# EAGLE design NRF24L01_LCD5110 (EAGLE 6.4)
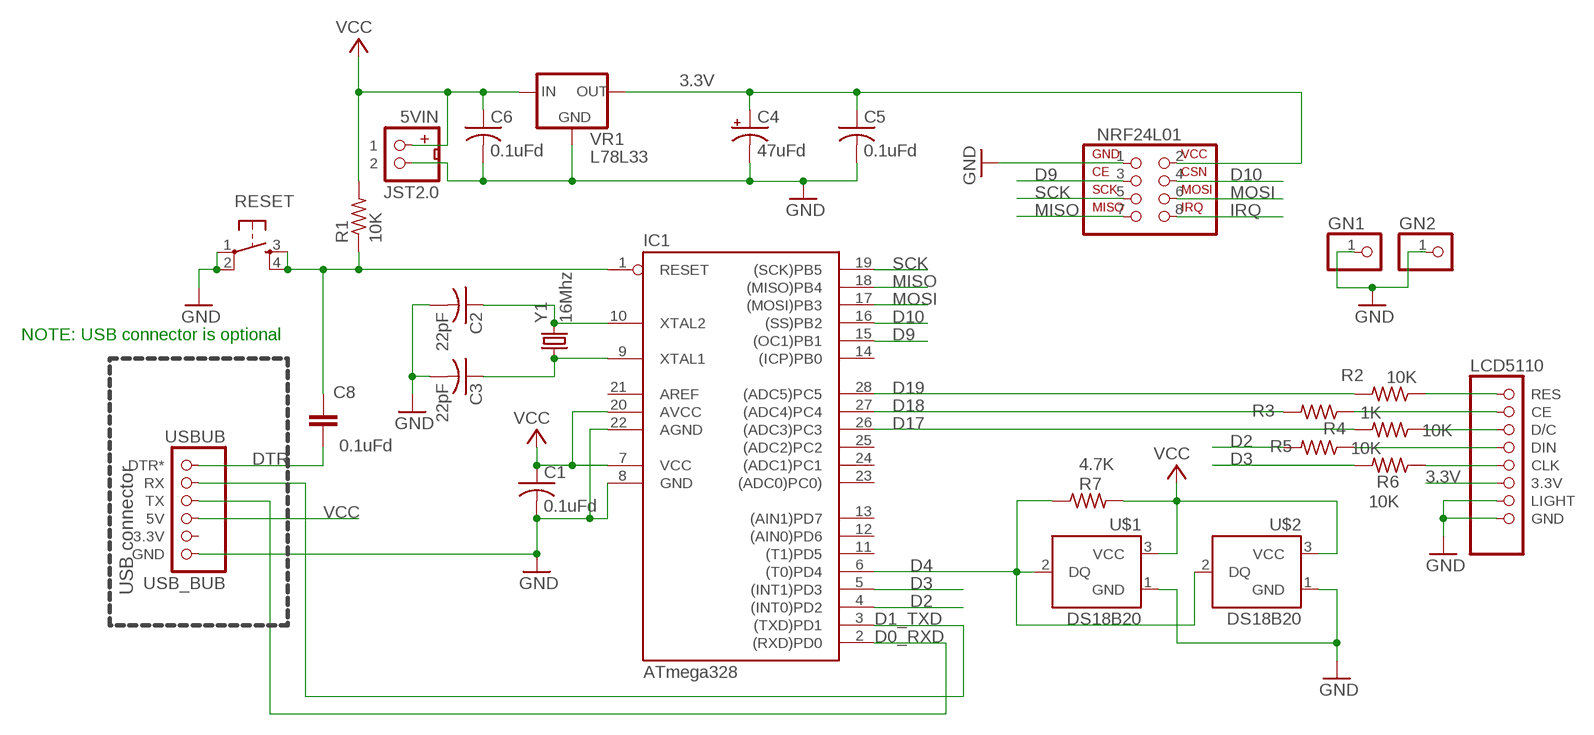
[diagram p0: schematic, sheet 1]

## Parts
5VIN  JST2.0  [JST2.0]
C1  0.1uFd  C-US050-025X075  [C050-025X075]
C2  22pF  C-US025-025X050  [C025-025X050]
C3  22pF  C-US025-025X050  [C025-025X050]
C4  47uFd  CPOL-USE2,5-6E  [E2,5-6E]
C5  0.1uFd  C-US025-025X050  [C025-025X050]
C6  0.1uFd  C-US050-025X075  [C050-025X075]
C8  0.1uFd  C-EU050-025X075  [C050-025X075]
GN1  PINHD-1X1  [1X01]
GN2  PINHD-1X1  [1X01]
IC1  ATmega328  AT90S4433P  [DIL28-3]
LCD5110  LCD5110_1TOP  [LCD5110T1]
NRF24L01  NRF24L01+  [NRF24L01+]
R1  10K  R-US_0207/2V  [0207/2V]
R2  10K  R-US_0207/5V  [0207/5V]
R3  1K  R-US_0207/5V  [0207/5V]
R4  10K  R-US_0207/5V  [0207/5V]
R5  10K  R-US_0207/5V  [0207/5V]
R6  10K  R-US_0207/5V  [0207/5V]
R7  4.7K  R-US_0207/2V  [0207/2V]
RESET  TAC_SWITCHPTH  [TACTILE-PTH]
U$1  DS18B20  [DS18B20]
U$2  DS18B20  [DS18B20]
USBUB  USB_BUB  [USB_BUB]
VR1  L78L33  78LXX  [78LXX]
Y1  16Mhz  CRYSTALHC49US  [HC49US]

## Nets
3.3V: C4.+ C5.1 LCD5110.3.3V NRF24L01.2 VR1.OUT
D0_RXD: IC1.2((RXD)PD0) USBUB.TX
D1_TXD: IC1.3((TXD)PD1) USBUB.RX
D2: IC1.4((INT0)PD2) R5.2
D3: IC1.5((INT1)PD3) R6.2
D4: IC1.6((T0)PD4) R7.1 U$1.2(DQ) U$2.2(DQ)
D9: IC1.15((OC1)PB1) NRF24L01.3
D10: IC1.16((SS)PB2) NRF24L01.4
D17: IC1.26((ADC3)PC3) R4.2
D18: IC1.27((ADC4)PC4) R3.2
D19: IC1.28((ADC5)PC5) R2.2
DTR: C8.1 USBUB.DTR*
GND [power]: 5VIN.2 C1.2 C2.2 C3.2 C4.- C5.2 C6.2 GN1.1 GN2.1 IC1.8(GND) IC1.22(AGND) LCD5110.GND LCD5110.LIGHT NRF24L01.1 RESET.1 RESET.2 U$1.1(GND) U$2.1(GND) USBUB.GND VR1.GND
IRQ: NRF24L01.8
MISO: IC1.18((MISO)PB4) NRF24L01.7
MOSI: IC1.17((MOSI)PB3) NRF24L01.6
N$1: LCD5110.RES R2.1
N$3: LCD5110.CE R3.1
N$5: LCD5110.D/C R4.1
N$6: C3.1 IC1.9(XTAL1) Y1.1
N$7: C2.1 IC1.10(XTAL2) Y1.2
N$8: LCD5110.DIN R5.1
N$9: LCD5110.CLK R6.1
RESET: C8.2 IC1.1(RESET) R1.1 RESET.3 RESET.4
SCK: IC1.19((SCK)PB5) NRF24L01.5
VCC: 5VIN.1 C1.1 C6.1 IC1.7(VCC) IC1.20(AVCC) R1.2 R7.2 U$1.3(VCC) U$2.3(VCC) USBUB.5V VR1.IN
Unconnected: IC1.11((T1)PD5) IC1.12((AIN0)PD6) IC1.13((AIN1)PD7) IC1.14((ICP)PB0) IC1.21(AREF) IC1.23((ADC0)PC0)) IC1.24((ADC1)PC1) IC1.25((ADC2)PC2) USBUB.3.3V

## Notes on the sheet
- NOTE: USB connector is optional
- USB connector

## Library data of the parts
5VIN = MTS_Custom:JST2.0
C1-C3 C5 C6 = MTS:C-US: CAPACITOR, American symbol
C4 = rcl:CPOL-US: POLARIZED CAPACITOR, American symbol
C8 = my-rcl:C-EU: CAPACITOR, European symbol
GN1 GN2 = pinhead:PINHD-1X1: PIN HEADER
IC1 = atmel:AT90S4433: MICROCONTROLLER 4 Kbytes FLASH 128 bytes SRAM 256 bytes EEPROM UART 6-channel 10 bit ADC
LCD5110 = MTS_Custom:LCD5110_1
NRF24L01 = MTS_Custom:NRF24L01+
R1-R7 = MTS:R-US_: RESISTOR, American symbol
RESET = SparkFun:TAC_SWITCH: Momentary Switch Button commonly used for reset or general input. Spark Fun Electronics SKU : COM-00097
U$1 U$2 = MTS_Custom:DS18B20
USBUB = MTS:USB_BUB
VR1 = v-reg:78LXX: VOLTAGE REGULATOR
Y1 = MTS:CRYSTAL: Crystals Various standard crystals. Proven footprints. Spark Fun Electronics SKU : COM-00534

## Net classes
0 default: width 0.4 mm, clearance 0.3 mm
1 power: width 0.6 mm, clearance 0.3 mm

## Board
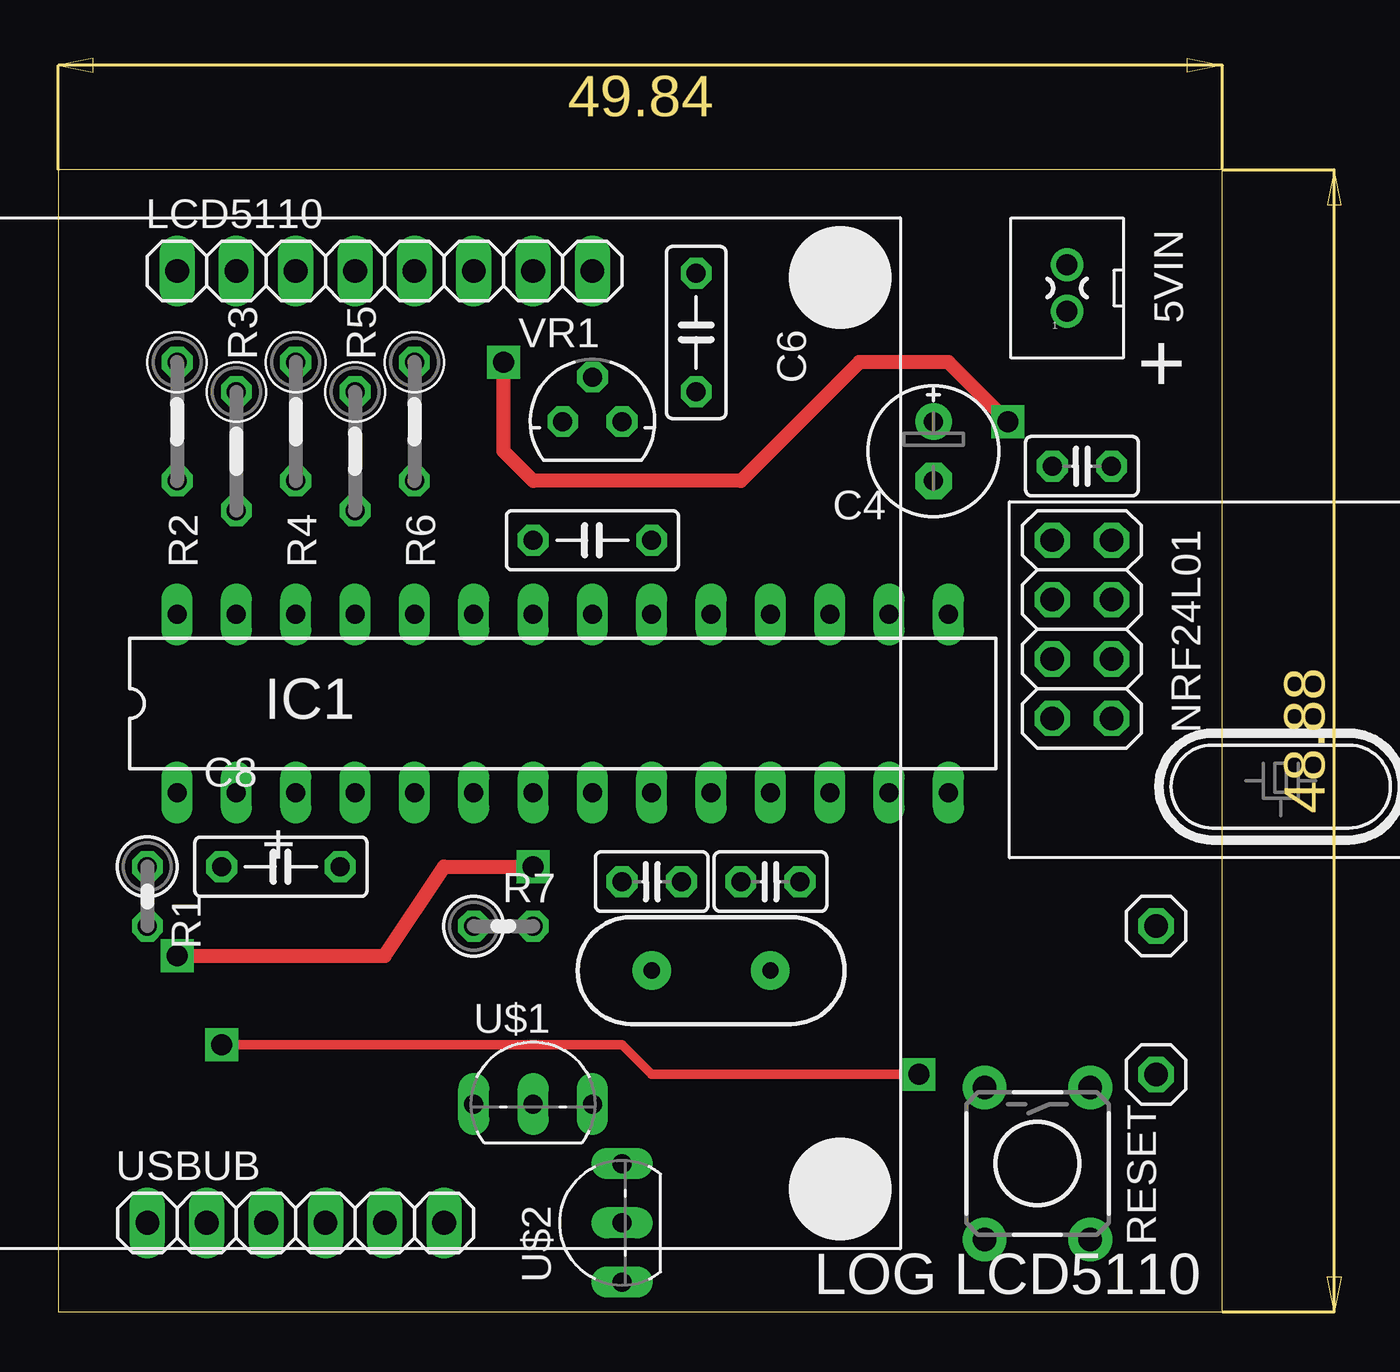
[diagram p1: board, top side]
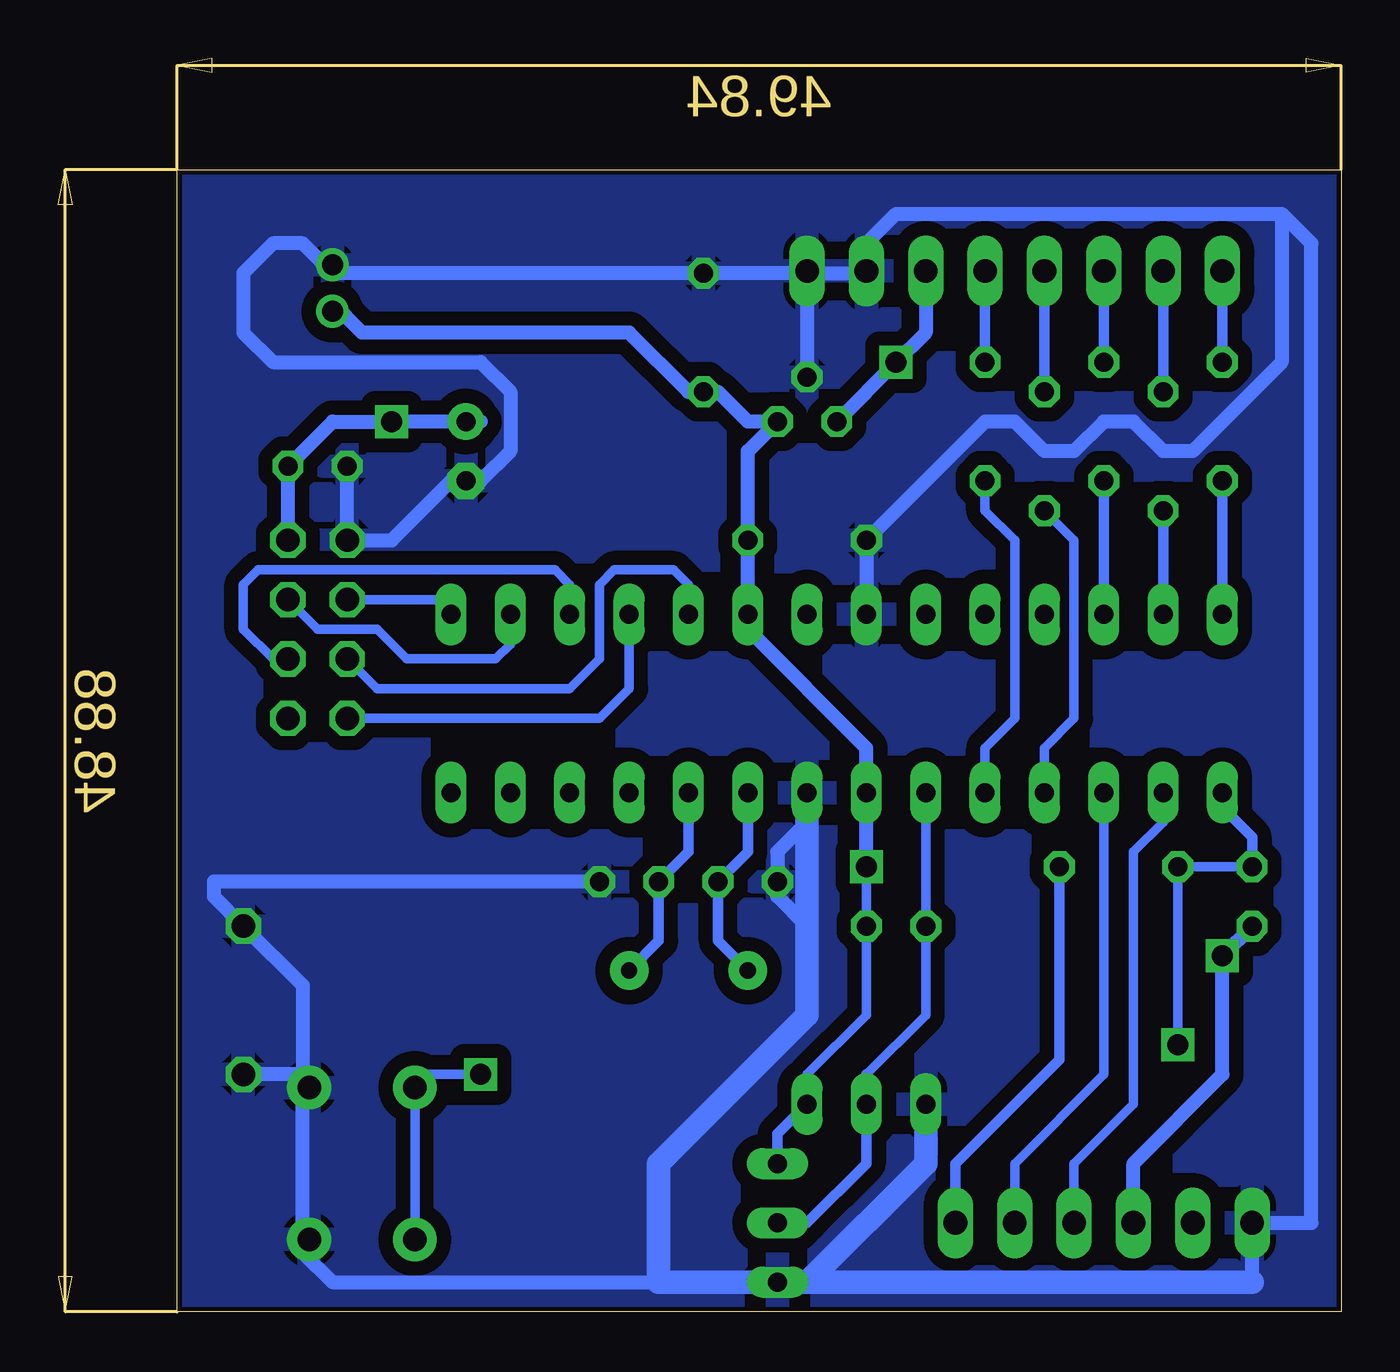
[diagram p2: board, bottom side, seen from below]

Size 49.84 x 48.88 mm. Coordinates in mm from the lower left corner, seen from the top.
Outline: 0,0 49.84,0 49.84,48.88 0,48.88 0,0
Copper layers (1*16): Top 0.035mm / dielectric 1.5mm / Bottom 0.035mm
Design rules "MTS1 *": minimum track width 18mil, minimum drill 12mil, track to track 24mil, track to pad 24mil, pad to pad 6mil, via to via 6mil, smd to smd 0mil, copper to edge 8mil, drill to drill 10mil, minimum pad ring 10mil, minimum via ring 10mil, stop-mask expansion 2mil, vias tented up to drill 25mil, thermal gap 10mil

### Footprints (pad centres in the part's own frame; a part is rotated, then mirrored left to right if it is on the bottom)
JST2.0 = drill 0.9 pad 1.016: 1 0,-1; 2 0,1
C050-025X075 = drill 0.813 octagon: 1 -2.54,0; 2 2.54,0
C025-025X050 = drill 0.813 octagon: 1 -1.27,0; 2 1.27,0
E2,5-6E = drill 0.813 pad 1.575: + -1.27,0 | drill 0.813 pad 1.575 octagon: - 1.27,0
1X01 = drill 1.016 octagon: 1 0,0
DIL28-3 = drill 0.813 long: 1 -16.51,-3.81; 2 -13.97,-3.81; 3 -11.43,-3.81; 4 -8.89,-3.81; 5 -6.35,-3.81; 6 -3.81,-3.81; 7 -1.27,-3.81; 8 1.27,-3.81; 9 3.81,-3.81; 10 6.35,-3.81; 11 8.89,-3.81; 12 11.43,-3.81; 13 13.97,-3.81; 14 16.51,-3.81; 15 16.51,3.81; 16 13.97,3.81; 17 11.43,3.81; 18 8.89,3.81; 19 6.35,3.81; 20 3.81,3.81; 21 1.27,3.81; 22 -1.27,3.81; 23 -3.81,3.81; 24 -6.35,3.81; 25 -8.89,3.81; 26 -11.43,3.81; 27 -13.97,3.81; 28 -16.51,3.81
LCD5110T1 = drill 1.016 long: 3.3V 3.81,19.78; CE -6.35,19.78; CLK 1.27,19.78; D/C -3.81,19.78; DIN -1.27,19.78; GND 8.89,19.78; LIGHT 6.35,19.78; RES -8.89,19.78
NRF24L01+ = drill 1 octagon: 1 -5.08,-12.7; 2 -5.08,-10.16; 3 -2.54,-12.7; 4 -2.54,-10.16; 5 0,-12.7; 6 0,-10.16; 7 2.54,-12.7; 8 2.54,-10.16
0207/2V = drill 0.813 octagon: 1 -1.27,0; 2 1.27,0
0207/5V = drill 0.813 octagon: 1 -2.54,0; 2 2.54,0
TACTILE-PTH = drill 1.016 pad 1.88: 1 -3.251,2.261; 2 3.251,2.261; 3 -3.251,-2.261; 4 3.251,-2.261
DS18B20 = drill 0.813 long: 1 -2.54,-1.27; 2 0,-1.27; 3 2.54,-1.27
USB_BUB = drill 1.016 long: 3.3V -3.81,0; 5V -1.27,0; DTR* 6.35,0; GND -6.35,0; RX 3.81,0; TX 1.27,0
78LXX = drill 0.813 octagon: GND 0,1.905; IN 1.27,0; OUT -1.27,0
HC49US = drill 0.7 pad 1.651: 1 -2.54,0; 2 2.54,0

### Placement (x,y rotation side)
5VIN  43.18,43.81 0 top
C1  22.86,33.02 180 top
C2  30.48,18.41 0 top
C3  25.4,18.41 180 top
C4  37.47,36.83 270 top
C5  43.81,36.2 180 top
C6  27.3,41.91 90 top
C8  9.53,19.05 180 top
GN1  46.99,16.51 0 top
GN2  46.99,10.16 0 top
IC1  21.59,26.04 0 top
LCD5110  13.97,24.77 0 top
NRF24L01  55.24,27.94 270 top
R1  3.81,17.78 270 top
R2  5.08,38.1 270 top
R3  7.62,36.83 270 top
R4  10.16,38.1 270 top
R5  12.7,36.83 270 top
R6  15.24,38.1 270 top
R7  19.05,16.51 0 top
RESET  41.91,6.35 270 top
U$1  20.32,10.16 0 top
U$2  22.86,3.81 90 top
USBUB  10.16,3.81 0 top
VR1  22.86,38.1 0 top
Y1  27.94,14.61 0 top

### Tracks (layer width: path | path; a pad name or v marks a point on that pad's centre or on a via)
3.3V  (via drill 0.9)
  Top 0.61: v40.64,38.1 38.1,40.64 34.29,40.64 29.21,35.56 20.32,35.56 19.05,36.83 v19.05,40.64
  Bottom 0.61: NRF24L01.2 C5.1 43.18,38.1 v40.64,38.1 C4.+ 36.83,38.1 | LCD5110.3.3V 17.78,41.91 v19.05,40.64 VR1.OUT
D0_RXD
  Bottom 0.406: IC1.2 7.62,20.95 8.89,19.68 8.89,8.89 11.43,6.35 USBUB.TX
D1_TXD
  Bottom 0.406: IC1.3 10.16,10.16 13.97,6.35 USBUB.RX
D2
  Bottom 0.406: IC1.4 12.7,24.13 11.43,25.4 11.43,33.02 R5.2
D3
  Bottom 0.406: IC1.5 15.24,24.13 13.97,25.4 13.97,33.02 15.24,34.29 R6.2
D4
  Bottom 0.406: 20.32,10.16 17.78,12.7 R7.1 IC1.6
  Bottom 0.457: U$2.2 22.86,3.81 20.32,6.35 U$1.2 20.32,10.16
D9
  Bottom 0.406: IC1.15 38.73,30.48 NRF24L01.3
D10
  Bottom 0.406: IC1.16 35.56,28.57 36.2,27.94 40.01,27.94 41.27,29.21 43.81,29.21 NRF24L01.4
D17
  Bottom 0.457: R4.2 IC1.26
D18
  Bottom 0.457: R3.2 IC1.27
D19
  Bottom 0.457: R2.2 IC1.28
DTR
  Bottom 0.457: C8.1 12.06,10.79 16.51,6.35 USBUB.DTR*
GND
  Bottom 0.6: 22.86,21.59 22.86,20.95 24.13,19.68 C3.2 24.13,17.78 22.86,16.51 22.86,12.7 | C2.2 48.26,18.41 48.26,17.78 GN1.1 44.45,13.97 44.45,10.16 | IC1.22 C1.2 15.24,38.1 13.97,38.1 12.7,36.83 11.43,36.83 10.16,38.1 8.89,38.1 7.62,36.83 6.35,36.83 2.54,40.64 2.54,46.99 | 3.81,1.27 USBUB.GND 1.27,3.81 1.27,45.72 2.54,46.99 | 29.21,1.27 43.18,1.27 44.45,2.54 RESET.2 44.45,3.81 44.45,8.89 RESET.1 44.45,10.16 | 44.45,10.16 GN2.1 | 22.86,44.45 VR1.GND | 22.86,44.45 C6.2 43.18,44.45 | 22.86,44.45 20.32,44.45 LCD5110.LIGHT 20.32,45.72 19.05,46.99 2.54,46.99 | 22.86,44.45 LCD5110.GND | NRF24L01.1 40.64,33.02 38.1,35.56 C4.- 36.83,35.56 35.56,36.83 35.56,39.37 36.83,40.64 45.72,40.64 46.99,41.91 46.99,44.45 45.72,45.72 44.45,45.72 43.18,44.45 | 43.18,44.45 5VIN.2
  Bottom 0.61: NRF24L01.1 C5.2
  Bottom 1.016: U$1.1 17.78,6.35 22.86,1.27 U$2.1 | IC1.8 22.86,21.59 22.86,12.7 29.21,6.35 29.21,1.27 U$2.1 | U$2.1 3.81,1.27
  pour Bottom: 0,0 50.8,0 50.8,49.53 0,49.53
MISO
  Bottom 0.406: NRF24L01.7 31.75,25.4 30.48,26.67 IC1.18
MOSI
  Bottom 0.406: NRF24L01.6 45.72,27.94 46.99,29.21 46.99,31.11 46.35,31.75 33.66,31.75 33.02,31.11 IC1.17
N$1
  Bottom 0.457: LCD5110.RES R2.1
N$3
  Bottom 0.457: LCD5110.CE R3.1
N$5
  Bottom 0.457: LCD5110.D/C R4.1
N$6
  Bottom 0.457: Y1.1 26.67,15.88 C3.1 25.4,19.68 IC1.9
N$7
  Bottom 0.457: Y1.2 29.21,15.88 C2.1 27.94,19.68 IC1.10
N$8
  Bottom 0.457: LCD5110.DIN R5.1
N$9
  Bottom 0.457: LCD5110.CLK R6.1
RESET  (via drill 0.9)
  Top 0.406: v36.83,10.16 25.4,10.16 24.13,11.43 v6.99,11.43
  Bottom 0.406: R1.1 C8.2 v6.99,11.43 | RESET.4 RESET.3 | RESET.3 39.65,9.88 | v36.83,10.16 39.37,10.16 39.37,9.88 RESET.3
  Bottom 0.457: R1.1 3.81,20.32 5.08,21.59 IC1.1
SCK
  Bottom 0.406: IC1.19 27.94,31.11 28.57,31.75 31.11,31.75 31.75,31.11 31.75,27.94 33.02,26.67 41.27,26.67 NRF24L01.5
VCC  (via drill 0.9)
  Top 0.61: v5.08,15.24 13.97,15.24 16.51,19.05 v20.32,19.05
  Bottom 0.406: U$1.3 22.86,10.16 20.32,12.7 R7.2 v20.32,19.05
  Bottom 0.457: 43.18,43.18 5VIN.1 | 27.94,39.37 C6.1 | U$2.3 24.13,7.62 U$1.3
  Bottom 0.61: C6.1 26.67,39.37 25.4,38.1 VR1.IN 25.4,36.83 C1.1 IC1.20 25.4,29.21 20.32,24.13 IC1.7 v20.32,19.05 | USBUB.5V 8.89,6.35 5.08,10.16 v5.08,15.24 R1.2 | 43.18,43.18 41.91,41.91 30.48,41.91 27.94,39.37

### Text on the board
tPlace: + | LOG LCD5110
tNames: +